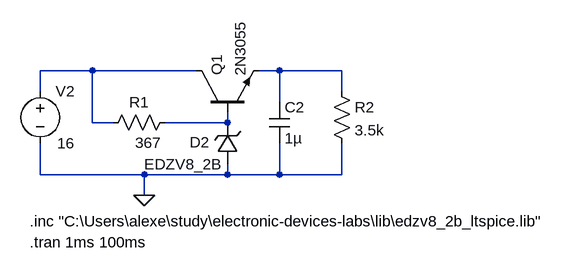
[diagram p0: schematic scheme5.asc]
scheme5.asc, the LTspice schematic file:
Version 4.1
SHEET 1 1416 680
WIRE -32 144 -112 144
WIRE 128 144 -32 144
WIRE 256 144 224 144
WIRE 352 144 256 144
WIRE -112 176 -112 144
WIRE 352 176 352 144
WIRE 256 192 256 144
WIRE -32 224 -32 144
WIRE 0 224 -32 224
WIRE 176 224 176 208
WIRE 176 224 80 224
WIRE -112 304 -112 256
WIRE 48 304 -112 304
WIRE 176 304 176 288
WIRE 176 304 48 304
WIRE 256 304 256 256
WIRE 256 304 176 304
WIRE 352 304 352 256
WIRE 352 304 256 304
WIRE 48 336 48 304
FLAG 48 336 0
SYMBOL voltage -112 160 R0
WINDOW 3 26 96 Left 2
SYMATTR Value 16
SYMATTR InstName V2
SYMBOL res 96 208 R90
WINDOW 0 0 56 VBottom 2
WINDOW 3 31 42 VTop 2
SYMATTR InstName R1
SYMATTR Value 367
SYMBOL zener 192 288 R180
WINDOW 0 43 34 Left 2
WINDOW 3 24 0 Left 2
SYMATTR InstName D2
SYMATTR Value EDZV8_2B
SYMBOL cap 240 192 R0
SYMATTR InstName C2
SYMATTR Value 1µ
SYMBOL res 336 160 R0
SYMATTR InstName R2
SYMATTR Value 3.5k
SYMBOL npn 128 208 R270
SYMATTR InstName Q1
SYMATTR Value 2N3055
TEXT -128 376 Left 2 !.inc "C:\\Users\\alexe\\study\\electronic-devices-labs\\lib\\edzv8_2b_ltspice.lib"
TEXT -128 408 Left 2 !.tran 1ms 100ms

The netlist it stands for:
* scheme5.asc
V2 N001 0 16
R1 N003 N001 367
D2 0 N003 EDZV8_2B
C2 N002 0 1µ
R2 N002 0 3.5k
Q1 N001 N003 N002 0 2N3055
.model D D
.lib standard.dio
.model NPN NPN
.model PNP PNP
.lib standard.bjt
.inc "C:\Users\alexe\study\electronic-devices-labs\lib\edzv8_2b_ltspice.lib"
.tran 1ms 100ms
.backanno
.end